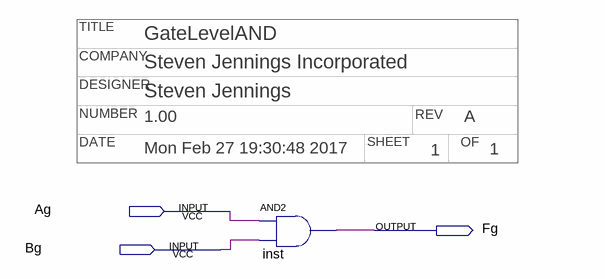
[diagram p0: schematic sheet]
// Quartus schematic GateLevelAND.bdf as structural Verilog: 1 symbols, 3 pins
// Title block: COMPANY: Steven Jennings Incorporated; DATE: Mon Feb 27 19:30:48 2017; DESIGNER: Steven Jennings; NUMBER: 1.00; OF: 1; REV: A; SHEET: 1; TITLE: GateLevelAND
module GateLevelAND (
  input  Ag,
  input  Bg,
  output Fg
);

  and inst (Fg, Ag, Bg);
endmodule
